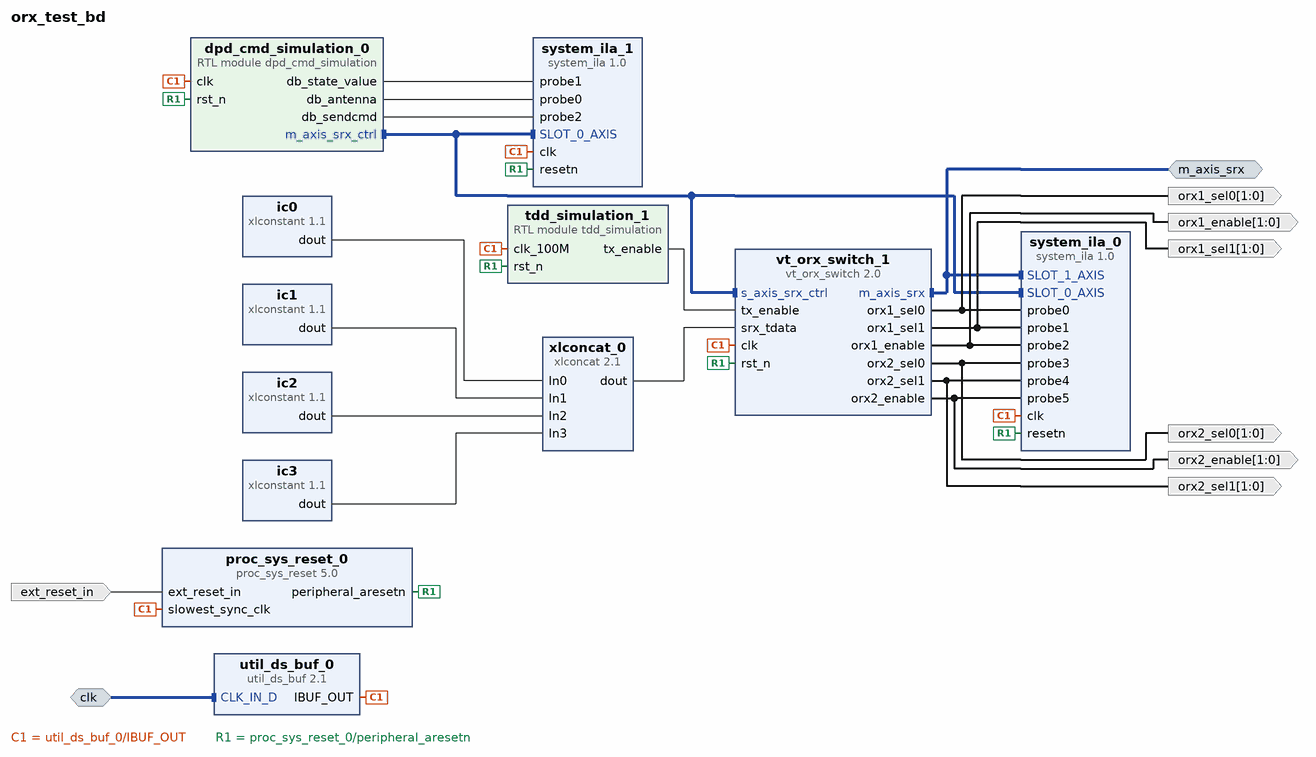
[diagram p0: block diagram of the top level]
# Vivado block design orx_test_bd, xczu9eg-ffvb1156-2-e, Vivado 2017.2.1
create_bd_design orx_test_bd

create_bd_intf_port -mode Slave -vlnv xilinx.com:interface:diff_clock_rtl:1.0 clk
create_bd_intf_port -mode Master -vlnv xilinx.com:interface:axis_rtl:1.0 m_axis_srx
create_bd_port -dir I -type rst ext_reset_in
set_property -dict {CONFIG.POLARITY ACTIVE_LOW} [get_bd_ports ext_reset_in]
create_bd_port -dir O -from 1 -to 0 orx1_sel0
create_bd_port -dir O -from 1 -to 0 orx1_sel1
create_bd_port -dir O -from 1 -to 0 orx1_enable
create_bd_port -dir O -from 1 -to 0 orx2_sel0
create_bd_port -dir O -from 1 -to 0 orx2_sel1
create_bd_port -dir O -from 1 -to 0 orx2_enable

create_bd_cell -type module -reference tdd_simulation tdd_simulation_1
set_property -dict {CONFIG.NUM_UL_SLOT 10 CONFIG.NUM_DL_SLOT 10} [get_bd_cells tdd_simulation_1]
create_bd_cell -type module -reference dpd_cmd_simulation dpd_cmd_simulation_0
set_property -dict {CONFIG.SWITCH_PERIOD 1000 CONFIG.NUM_ANTENNA 4} [get_bd_cells dpd_cmd_simulation_0]
create_bd_cell -type ip -vlnv xilinx.com:ip:xlconstant:1.1 ic1
set_property -dict {CONFIG.CONST_WIDTH 32 CONFIG.CONST_VAL 1} [get_bd_cells ic1]
create_bd_cell -type ip -vlnv xilinx.com:ip:xlconstant:1.1 ic2
set_property -dict {CONFIG.CONST_WIDTH 32 CONFIG.CONST_VAL 2} [get_bd_cells ic2]
create_bd_cell -type ip -vlnv xilinx.com:ip:xlconstant:1.1 ic3
set_property -dict {CONFIG.CONST_WIDTH 32 CONFIG.CONST_VAL 3} [get_bd_cells ic3]
create_bd_cell -type ip -vlnv xilinx.com:ip:proc_sys_reset:5.0 proc_sys_reset_0
set_property -dict {CONFIG.C_AUX_RESET_HIGH 0} [get_bd_cells proc_sys_reset_0]
create_bd_cell -type ip -vlnv xilinx.com:ip:system_ila:1.0 system_ila_1
set_property -dict [list \
  CONFIG.C_PROBE2_WIDTH 1 \
  CONFIG.C_PROBE1_WIDTH 3 \
  CONFIG.C_PROBE0_WIDTH 4 \
  CONFIG.C_DATA_DEPTH 65536 \
  CONFIG.C_NUM_OF_PROBES 3 \
  CONFIG.C_SLOT_0_AXIS_TDATA_WIDTH 8 \
  CONFIG.C_SLOT_0_AXIS_TID_WIDTH 0 \
  CONFIG.C_SLOT_0_AXIS_TUSER_WIDTH 0 \
  CONFIG.C_SLOT_0_AXIS_TDEST_WIDTH 0 \
  CONFIG.C_SLOT_0_INTF_TYPE xilinx.com:interface:axis_rtl:1.0 \
  CONFIG.C_MON_TYPE MIX \
  CONFIG.C_PROBE_WIDTH_PROPAGATION MANUAL \
] [get_bd_cells system_ila_1]
create_bd_cell -type ip -vlnv xilinx.com:ip:util_ds_buf:2.1 util_ds_buf_0
set_property -dict {CONFIG.DIFF_CLK_IN_BOARD_INTERFACE Custom} [get_bd_cells util_ds_buf_0]
create_bd_cell -type ip -vlnv xilinx.com:ip:xlconcat:2.1 xlconcat_0
set_property -dict [list \
  CONFIG.NUM_PORTS 4 \
  CONFIG.IN0_WIDTH 32 \
  CONFIG.IN1_WIDTH 32 \
  CONFIG.IN2_WIDTH 32 \
  CONFIG.IN3_WIDTH 32 \
  CONFIG.dout_width 128 \
] [get_bd_cells xlconcat_0]
create_bd_cell -type ip -vlnv xilinx.com:ip:xlconstant:1.1 ic0
set_property -dict {CONFIG.CONST_WIDTH 32 CONFIG.CONST_VAL 0} [get_bd_cells ic0]
create_bd_cell -type ip -vlnv xilinx.com:ip:system_ila:1.0 system_ila_0
set_property -dict [list \
  CONFIG.C_SLOT 1 \
  CONFIG.C_PROBE5_WIDTH 2 \
  CONFIG.C_PROBE4_WIDTH 2 \
  CONFIG.C_PROBE3_WIDTH 2 \
  CONFIG.C_PROBE2_WIDTH 2 \
  CONFIG.C_PROBE1_WIDTH 2 \
  CONFIG.C_PROBE0_WIDTH 2 \
  CONFIG.C_DATA_DEPTH 32768 \
  CONFIG.C_NUM_OF_PROBES 6 \
  CONFIG.C_NUM_MONITOR_SLOTS 2 \
  CONFIG.C_SLOT_0_AXIS_TDATA_WIDTH 8 \
  CONFIG.C_SLOT_0_AXIS_TID_WIDTH 0 \
  CONFIG.C_SLOT_0_AXIS_TUSER_WIDTH 0 \
  CONFIG.C_SLOT_0_AXIS_TDEST_WIDTH 0 \
  CONFIG.C_SLOT_1_AXIS_TDATA_WIDTH 32 \
  CONFIG.C_SLOT_1_AXIS_TID_WIDTH 0 \
  CONFIG.C_SLOT_1_AXIS_TUSER_WIDTH 8 \
  CONFIG.C_SLOT_1_AXIS_TDEST_WIDTH 0 \
  CONFIG.C_SLOT_0_INTF_TYPE xilinx.com:interface:axis_rtl:1.0 \
  CONFIG.C_SLOT_1_INTF_TYPE xilinx.com:interface:axis_rtl:1.0 \
  CONFIG.C_MON_TYPE MIX \
  CONFIG.C_PROBE_WIDTH_PROPAGATION MANUAL \
] [get_bd_cells system_ila_0]
create_bd_cell -type ip -vlnv vttek.com.vn:user:vt_orx_switch:2.0 vt_orx_switch_1
set_property -dict {CONFIG.NUM_IC 2} [get_bd_cells vt_orx_switch_1]

# ---- connections ----

connect_bd_intf_net [get_bd_intf_pins dpd_cmd_simulation_0/m_axis_srx_ctrl] [get_bd_intf_pins vt_orx_switch_1/s_axis_srx_ctrl]
connect_bd_intf_net [get_bd_intf_pins dpd_cmd_simulation_0/m_axis_srx_ctrl] [get_bd_intf_pins system_ila_1/SLOT_0_AXIS]
connect_bd_intf_net [get_bd_intf_pins dpd_cmd_simulation_0/m_axis_srx_ctrl] [get_bd_intf_pins system_ila_0/SLOT_0_AXIS]
connect_bd_intf_net [get_bd_intf_ports clk] [get_bd_intf_pins util_ds_buf_0/CLK_IN_D]
connect_bd_intf_net -intf_net vt_orx_switch_0_m_axis_srx [get_bd_intf_ports m_axis_srx] [get_bd_intf_pins vt_orx_switch_1/m_axis_srx]
connect_bd_intf_net [get_bd_intf_ports m_axis_srx] [get_bd_intf_pins system_ila_0/SLOT_1_AXIS]
connect_bd_net -net clk_1 [get_bd_pins util_ds_buf_0/IBUF_OUT] \
  [get_bd_pins tdd_simulation_1/clk_100M] [get_bd_pins dpd_cmd_simulation_0/clk] \
  [get_bd_pins proc_sys_reset_0/slowest_sync_clk] [get_bd_pins system_ila_1/clk] [get_bd_pins system_ila_0/clk] \
  [get_bd_pins vt_orx_switch_1/clk]
connect_bd_net [get_bd_pins proc_sys_reset_0/peripheral_aresetn] \
  [get_bd_pins tdd_simulation_1/rst_n] [get_bd_pins dpd_cmd_simulation_0/rst_n] [get_bd_pins system_ila_1/resetn] \
  [get_bd_pins system_ila_0/resetn] [get_bd_pins vt_orx_switch_1/rst_n]
connect_bd_net [get_bd_ports ext_reset_in] [get_bd_pins proc_sys_reset_0/ext_reset_in]
connect_bd_net -net vt_orx_switch_0_orx1_sel0 [get_bd_pins vt_orx_switch_1/orx1_sel0] [get_bd_ports orx1_sel0] [get_bd_pins system_ila_0/probe0]
connect_bd_net -net vt_orx_switch_0_orx1_sel1 [get_bd_pins vt_orx_switch_1/orx1_sel1] [get_bd_ports orx1_sel1] [get_bd_pins system_ila_0/probe1]
connect_bd_net -net vt_orx_switch_0_orx1_enable [get_bd_pins vt_orx_switch_1/orx1_enable] [get_bd_ports orx1_enable] [get_bd_pins system_ila_0/probe2]
connect_bd_net -net vt_orx_switch_0_orx2_sel0 [get_bd_pins vt_orx_switch_1/orx2_sel0] [get_bd_ports orx2_sel0] [get_bd_pins system_ila_0/probe3]
connect_bd_net -net vt_orx_switch_0_orx2_sel1 [get_bd_pins vt_orx_switch_1/orx2_sel1] [get_bd_ports orx2_sel1] [get_bd_pins system_ila_0/probe4]
connect_bd_net -net vt_orx_switch_0_orx2_enable [get_bd_pins vt_orx_switch_1/orx2_enable] [get_bd_ports orx2_enable] [get_bd_pins system_ila_0/probe5]
connect_bd_net [get_bd_pins dpd_cmd_simulation_0/db_state_value] [get_bd_pins system_ila_1/probe1]
connect_bd_net [get_bd_pins dpd_cmd_simulation_0/db_antenna] [get_bd_pins system_ila_1/probe0]
connect_bd_net [get_bd_pins dpd_cmd_simulation_0/db_sendcmd] [get_bd_pins system_ila_1/probe2]
connect_bd_net [get_bd_pins xlconcat_0/dout] [get_bd_pins vt_orx_switch_1/srx_tdata]
connect_bd_net [get_bd_pins tdd_simulation_1/tx_enable] [get_bd_pins vt_orx_switch_1/tx_enable]
connect_bd_net -net xlconstant_0_dout [get_bd_pins ic0/dout] [get_bd_pins xlconcat_0/In0]
connect_bd_net [get_bd_pins ic1/dout] [get_bd_pins xlconcat_0/In1]
connect_bd_net [get_bd_pins ic2/dout] [get_bd_pins xlconcat_0/In2]
connect_bd_net [get_bd_pins ic3/dout] [get_bd_pins xlconcat_0/In3]

validate_bd_design
save_bd_design
